# EAGLE schematic Switcher (EAGLE 7.2.0)
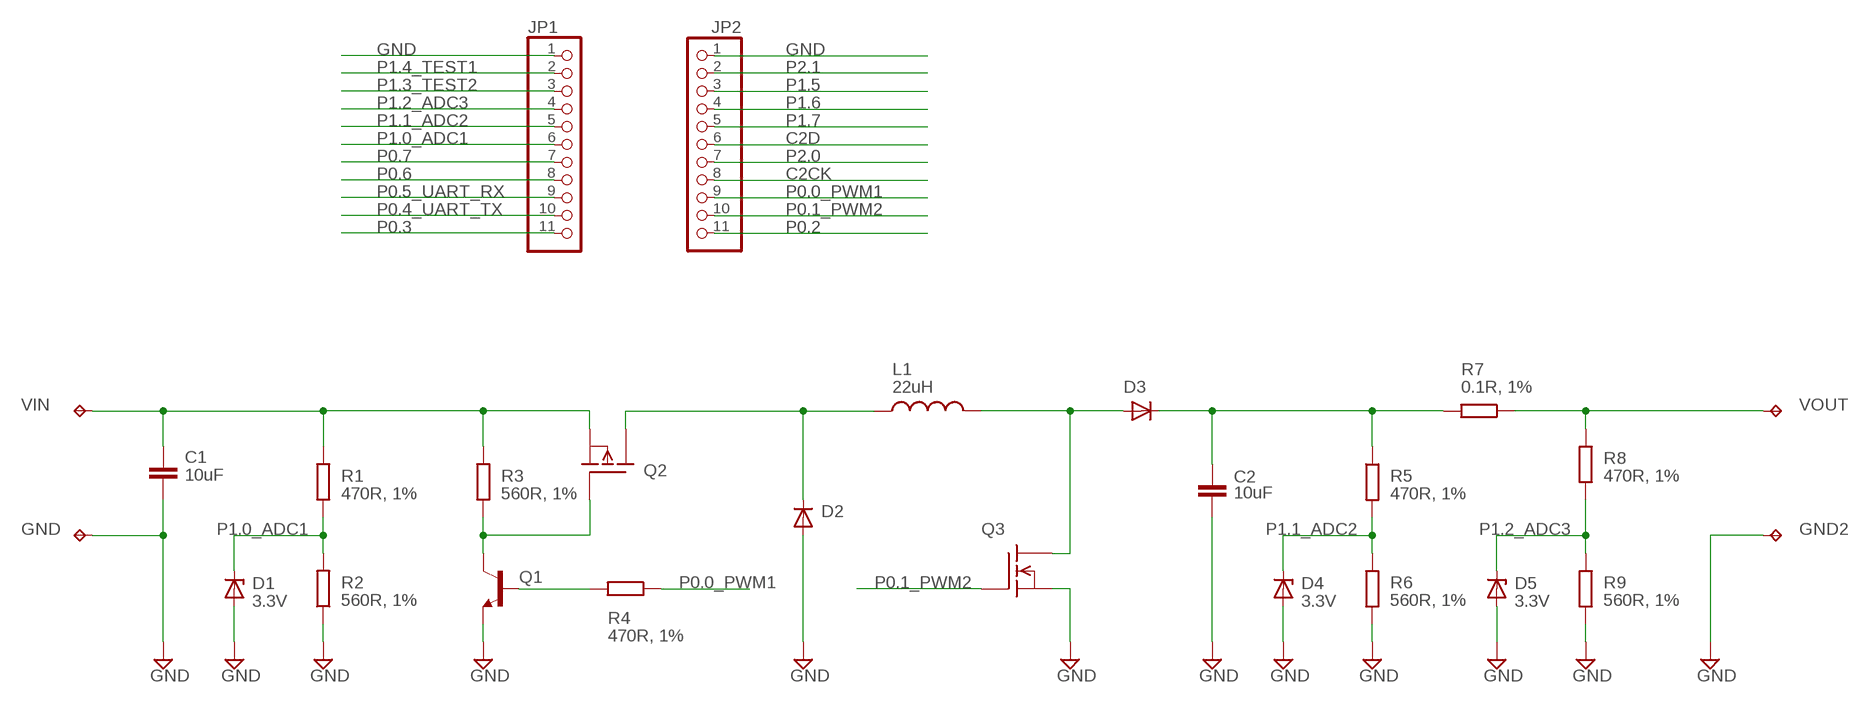
[diagram p0: schematic, sheet 1]

## Parts
C1  10uF  C-EU025-024X044  [C025-024X044]
C2  10uF  C-EU025-024X044  [C025-024X044]
D1  3.3V  ZENER-DIODEP1-Z12  [P1Z12]
D2  D-A1-C3  [SOT23]
D3  D-A1-C3  [SOT23]
D4  3.3V  ZENER-DIODEP1-Z12  [P1Z12]
D5  3.3V  ZENER-DIODEP1-Z12  [P1Z12]
GND  TPTP19R  [TP19R]
GND2  TPTP19R  [TP19R]
JP1  PINHD-1X11/90  [1X11/90]
JP2  PINHD-1X11/90  [1X11/90]
L1  22uH  L-US0204/5  [0204/5]
Q1  2N2222  [TO18]
Q2  BSS110  [TO92]
Q3  BSS296  [TO92]
R1  470R, 1%  R-EU_0207/10  [0207/10]
R2  560R, 1%  R-EU_0207/10  [0207/10]
R3  560R, 1%  R-EU_0207/10  [0207/10]
R4  470R, 1%  R-EU_0207/10  [0207/10]
R5  470R, 1%  R-EU_0207/10  [0207/10]
R6  560R, 1%  R-EU_0207/10  [0207/10]
R7  0.1R, 1%  R-EU_0207/10  [0207/10]
R8  470R, 1%  R-EU_0207/10  [0207/10]
R9  560R, 1%  R-EU_0207/10  [0207/10]
VIN  TPTP19R  [TP19R]
VOUT  TPTP19R  [TP19R]

## Nets
C2CK: JP2.8
C2D: JP2.6
GND: C1.2 C2.2 D1.A D2.1(A) D4.A D5.A GND2.TP GND.TP JP2.1 Q1.1(E) Q3.3(S) R2.1 R6.2 R9.2
N$2: C1.1 Q2.1(S) R1.2 R3.2 VIN.TP
N$4: Q1.3(C) Q2.2(G) R3.1
N$5: D2.3(C) L1.1 Q2.3(D)
N$6: Q1.2(B) R4.2
N$8: D3.1(A) L1.2 Q3.2(D)
N$10: C2.1 D3.3(C) R5.1 R7.2
N$12: R7.1 R8.1 VOUT.TP
P0.0_PWM1: JP2.9 R4.1
P0.1_PWM2: JP2.10 Q3.1(G)
P0.2: JP2.11
P0.3: JP1.11
P0.4_UART_TX: JP1.10
P0.5_UART_RX: JP1.9
P0.6: JP1.8
P0.7: JP1.7
P1.0_ADC1: D1.C JP1.6 R1.1 R2.2
P1.1_ADC2: D4.C JP1.5 R5.2 R6.1
P1.2_ADC3: D5.C JP1.4 R8.2 R9.1
P1.3_TEST2: JP1.3
P1.4_TEST1: JP1.2
P1.5: JP2.3
P1.6: JP2.4
P1.7: JP2.5
P2.0: JP2.7
P2.1: JP2.2
Unconnected: JP1.1

## Library data of the parts
C1 C2 = resistor:C-EU: CAPACITOR, European symbol
D1 D4 D5 = diode:ZENER-DIODE: Z-Diode
D2 D3 = semicon-smd-ipc:D-: DIODE unfilled
GND GND2 VIN VOUT = testpad:TP: Test pad
JP1 JP2 = pinhead:PINHD-1X11: PIN HEADER
L1 = resistor:L-US: INDUCTOR, American symbol
Q1 = transistor:2N2222: NPN TRANSISTOR
Q2 = transistor-fet:BSS110: P-Channel Enhancement MOSFET -50V; -0,17A; 6Ohm
Q3 = transistor-fet:BSS296: N-Channel Enhancement MOSFET not checked
R1-R9 = resistor:R-EU_: RESISTOR, European symbol